# Altium schematic sheet KMX62.SchDoc
size A
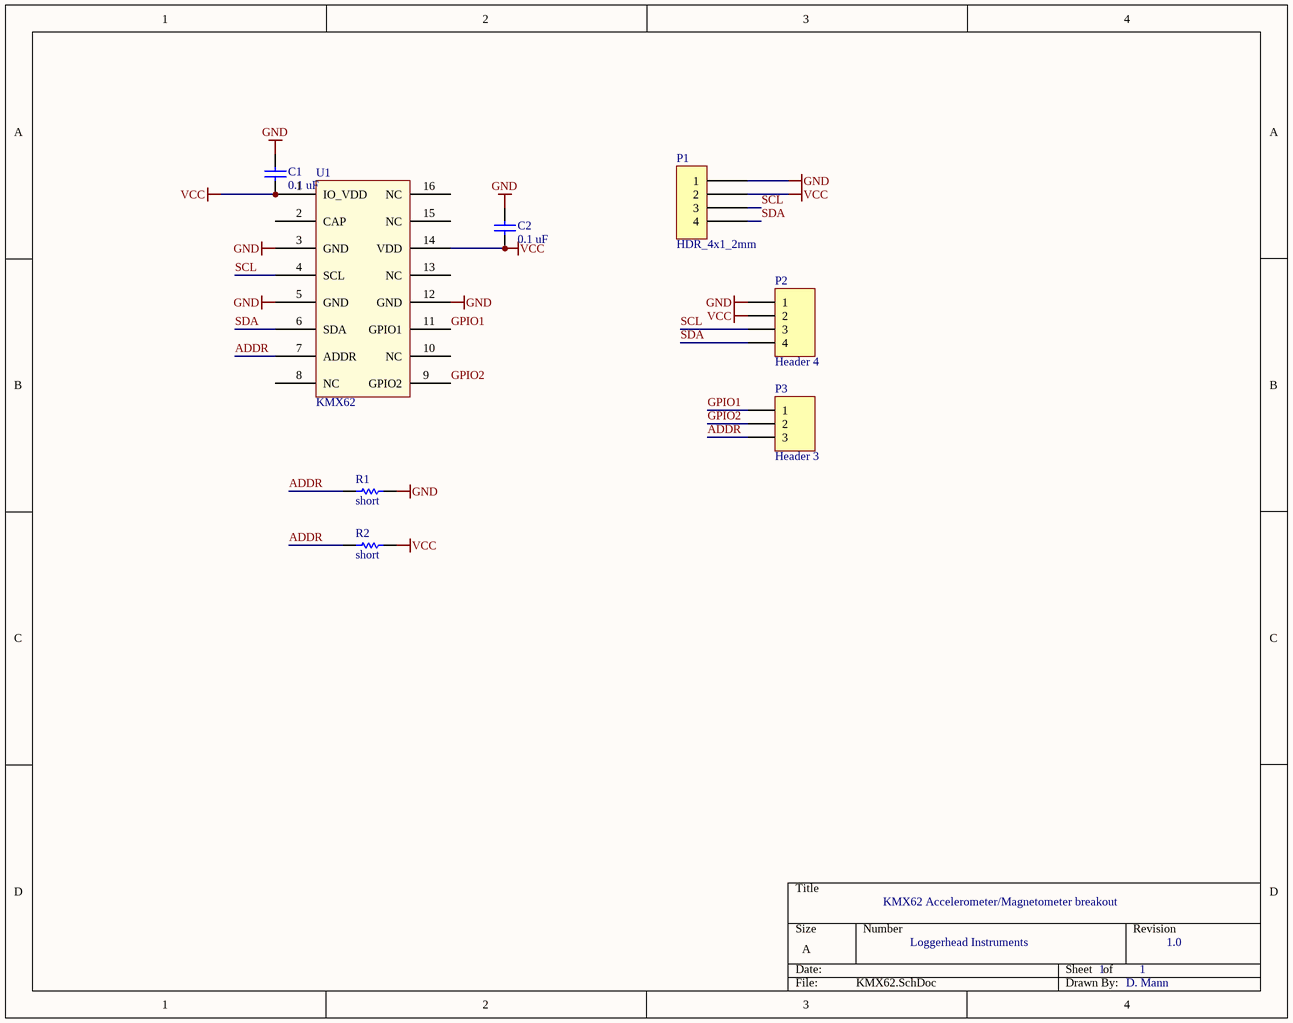
[diagram p0: KMX62.SchDoc]

## Parts
C1  0.1 uF  [0402]
C2  0.1 uF  [0402]
P1  HDR_4x1_2mm  [Hdr_4x1_2mm]
P2  Header 4  [HDR1X4]
P3  Header 3  [HDR1X3]
R1  short  [3-0603]
R2  short  [3-0603]
U1  KMX62  [Kionix_3x3_LGA16]

## Nets
GND: C1.1 C2.1 P1.1 P2.1 R1.1 U1.3(GND) U1.5(GND) U1.12(GND)
VCC: C1.2 C2.2 P1.2 P2.2 R2.1 U1.1(IO_VDD) U1.14(VDD)
ADDR: P3.3 R1.2 R2.2 U1.7(ADDR)
GPIO1: P3.1 U1.11(GPIO1)
GPIO2: P3.2 U1.9(GPIO2)
SCL: P1.3 P2.3 U1.4(SCL)
SDA: P1.4 P2.4 U1.6(SDA)

Not connected (* = marked no-connect by the designer): U1 2(CAP) 8(NC) 10(NC) 13(NC) 15(NC) 16(NC)

## Notes on the sheet
- KMX62 Accelerometer/Magnetometer breakout
- Loggerhead Instruments
- 1
- 1.0
- D. Mann

## Library data of the parts
C1 C2 = C0402: Ceramic Chip Capacitor - Standard; Note: Footprint corresponds to dimensions for bulk cassette packaging. This case size has tightened tolerances.; Value: 0.1uF; Published: 17-Jul-2002; LatestRevisionDate: 19-Mar-2004; LatestRevisionNote: Silkscreen size reduced.; DatasheetDocument: Mar-2001; PackageDocument: Mar-2001; PackageReference: 0402; Publisher: Altium Limited; Code_JEITA: 0402; Code_IPC: 1005 [0402]; ComponentLink1Description: Manufacturer Link; ComponentLink1URL: http://www.kemet.com/; ComponentLink2Description: Datasheet; ComponentLink2URL: http://www.kemet.com/kemet/web/homepage/kechome.nsf/vapubfilesname/F3102TA.pdf/$file/F3102TA.pdf
P2 = Header 4: Header, 4-Pin; LatestRevisionDate: 17-Jul-2002; LatestRevisionNote: Re-released for DXP Platform.; Publisher: Altium Limited
P3 = Header 3: Header, 3-Pin; LatestRevisionDate: 17-Jul-2002; LatestRevisionNote: Re-released for DXP Platform.; Publisher: Altium Limited
R1 R2 = ERJ3RK: Precision Thick Film Chip Resistor, 10 Ohm to 1M Ohm Range, 1% and 0.5% Tolerance, 0603 Size, 0.063 W; Published: 17-Dec-2003; LatestRevisionDate: 19-Mar-2004; LatestRevisionNote: Silkscreen size reduced.; PackageDocument: Mar-2003; PackageReference: 3-0603; Publisher: Altium Limited; Code_IPC: 1608 [0603]; ComponentLink1Description: Manufacturer Link; ComponentLink1URL: http://www.panasonic.com/industrial/components/resistive_products.htm; ComponentLink2Description: Datasheet; ComponentLink2URL: http://www.panasonic.com/industrial/components/pdf/AOA0000CE2.pdf
U1 = KMX62: Kionix Accel/Mag